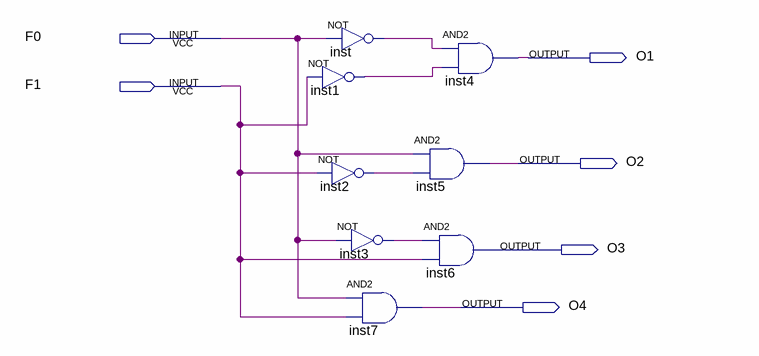
[diagram p0: schematic sheet]
// Quartus schematic decoder_2x4.bdf as structural Verilog: 8 symbols, 6 pins
module decoder_2x4 (
  input  F0,
  input  F1,
  output O1,
  output O2,
  output O3,
  output O4
);

  wire inst1_out, inst2_out, inst3_out, inst_out;

  not inst (inst_out, F0);
  not inst1 (inst1_out, F1);
  not inst2 (inst2_out, F1);
  not inst3 (inst3_out, F0);
  and inst7 (O4, F0, F1);
  and inst5 (O2, F0, inst2_out);
  and inst6 (O3, inst3_out, F1);
  and inst4 (O1, inst_out, inst1_out);
endmodule
